# Altium project Nixie-imponator-pcb-boost.PrjPCB
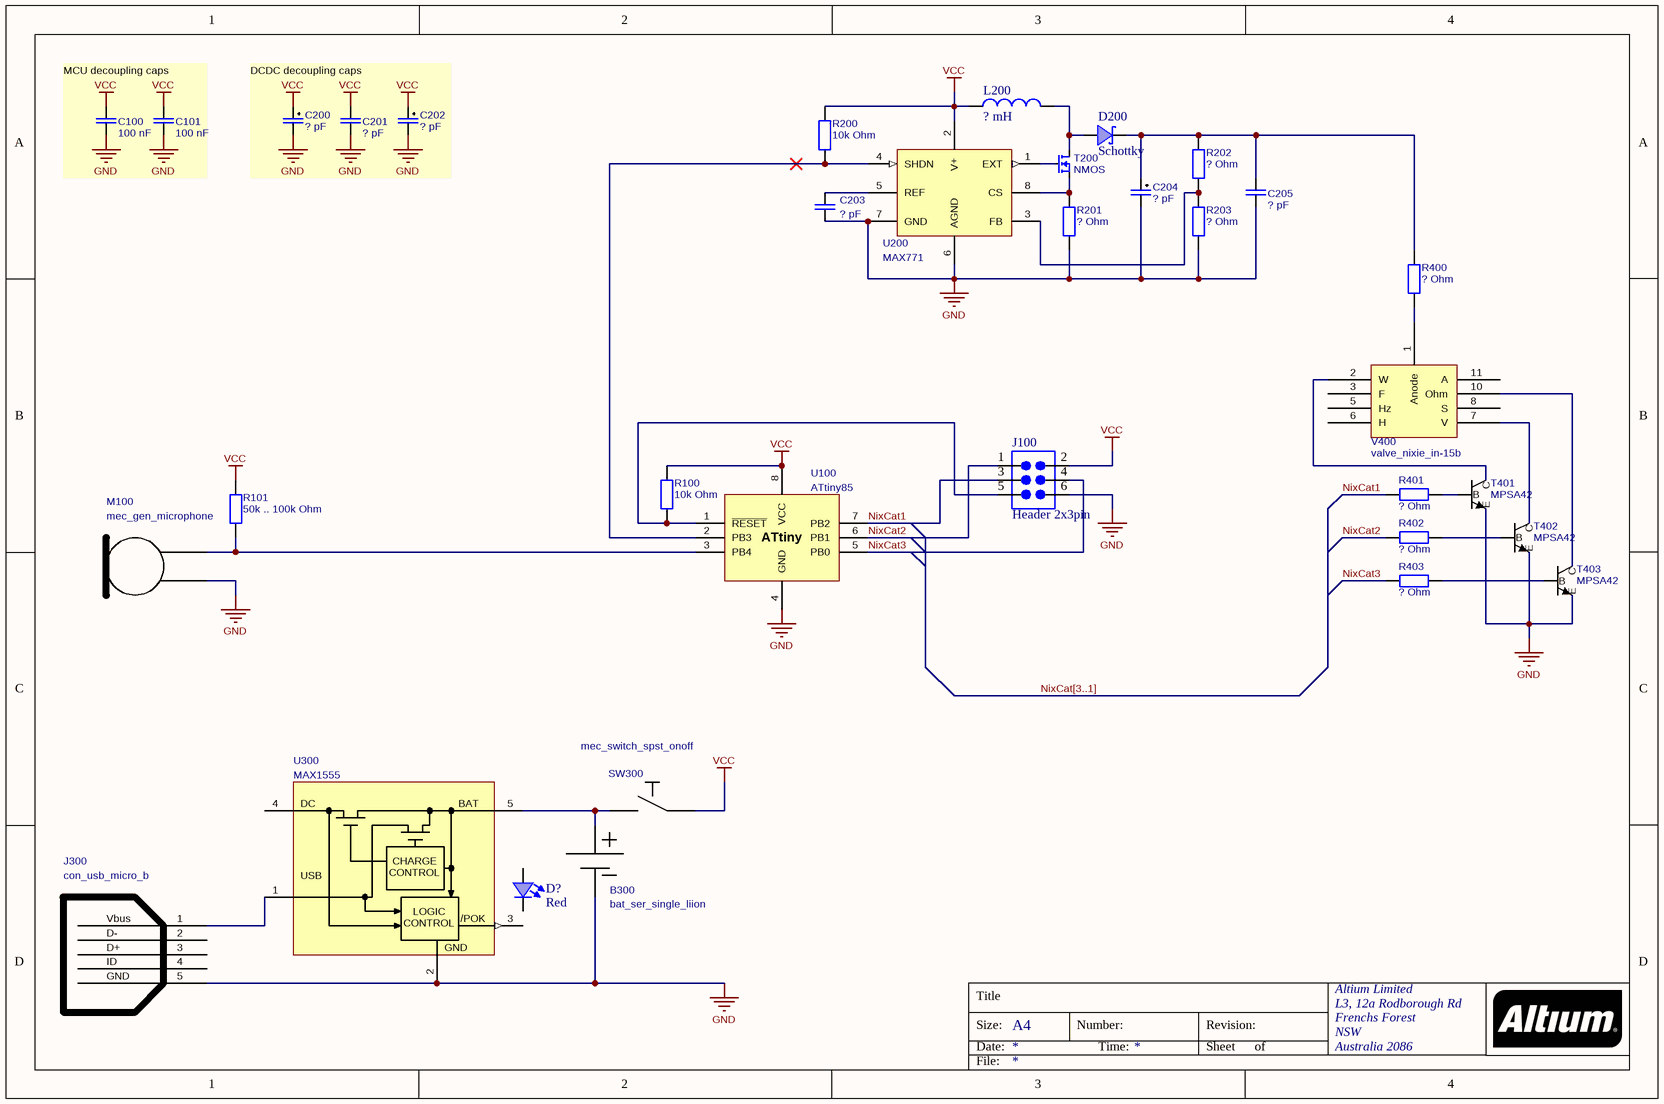
[diagram p0: Nixie-imp-boost-v1.SchDoc]
1 sheet, 34 parts. Net scope: global (net labels, ports and power ports of the same name join across sheets).
Board file: nixie-imp-v1.PcbDoc

## Sheet Nixie-imp-boost-v1.SchDoc
size A4; Organization: Altium Limited; Address1: L3, 12a Rodborough Rd; Address2: Frenchs Forest; Address3: NSW; Address4: Australia 2086

### Parts
B300  bat_ser_single_liion
C100  100 nF
C101  100 nF
C200  ? pF
C201  ? pF
C202  ? pF
C203  ? pF
C204  ? pF
C205  ? pF
D200  Schottky
D?  Red
J100  Header 2x3pin  [header_2x3]
J300  con_usb_micro_b
L200  ? mH  [ELLATV]
M100  mec_gen_microphone
R100  10k Ohm
R101  50k .. 100k Ohm
R200  10k Ohm
R201  ? Ohm
R202  ? Ohm
R203  ? Ohm
R400  ? Ohm
R401  ? Ohm
R402  ? Ohm
R403  ? Ohm
SW300  mec_switch_spst_onoff
T200  NMOS
T401  MPSA42
T402  MPSA42
T403  MPSA42
U100  ATtiny85
U200  MAX771
U300  MAX1555
V400  valve_nixie_in-15b

### Nets
GND: B300.2(-) C100.1 C101.1 C200.1 C201.1 C202.1 C203.1 C204.1 C205.1 J100.6 J300.5(GND) M100.Negative_output R201.2 R203.2 T401.E T402.E T403.E U100.4(GND) U200.6(AGND) U200.7(GND) U300.2(GND)
VCC: C100.2 C101.2 C200.2 C201.2 C202.2 J100.2 L200.1 R100.1 R101.1 R200.1 SW300.2 U100.8(VCC) U200.2(V+)
NixCat1: J100.3 R401.2 U100.7(PB2)
NixCat2: J100.1 R402.2 U100.6(PB1)
NixCat3: J100.4 R403.2 U100.5(PB0)
NetB300_1: B300.1(+) SW300.1 U300.5(BAT)
NetC203_2: C203.2 U200.5(REF)
NetC204_2: C204.2 C205.2 D200.2(C) R202.1 R400.1
NetD200_1: D200.1(A) L200.2 T200.D
NetJ100_5: J100.5 R100.2 U100.1(~{RESET})
NetJ300_1: J300.1(Vbus) U300.1(USB)
NetM100_Positive output: M100.Positive_output R101.2 U100.3(PB4)
NetR200_2: R200.2 U100.2(PB3) U200.4(SHDN)
NetR201_1: R201.1 T200.S U200.8(CS)
NetR202_2: R202.2 R203.1 U200.3(FB)
NetR400_2: R400.2 V400.1(Anode)
NetR401_1: R401.1 T401.B
NetR402_1: R402.1 T402.B
NetR403_1: R403.1 T403.B
NetT200_G: T200.G U200.1(EXT)
NetT401_C: T401.C V400.2(W)
NetT402_C: T402.C V400.7(V)
NetT403_C: T403.C V400.10(Ohm)

Not connected (* = marked no-connect by the designer): D? 1(A) 2(C); J300 2(D-) 3(D+) 4(ID); U300 3(~{PO}K_~{(CH}G)) 4(DC); V400 3(F) 5(Hz) 6(H) 8(S) 11(A)

### Buses and harness runs
bus NixCat[3..1]

### Notes on the sheet
- MCU decoupling caps
- DCDC decoupling caps
- (near R203) Maybe add potmeter to adjust voltage?
- (near R400) This resistor must be sized so to limit the anode current. If not, the anode will burn up!
- Title
- Size:
- Date:
- A4
- Number:
- Time:
- Revision:
- Sheet
- of
- File:
- (in symbol ic_batteryCharger_max1555) CHARGE / CONTROL; /POK; LOGIC / CONTROL
- (in symbol ic_mcu_8bit_atmel_attiny_25_45_85) ATtiny

### Library data of the parts
C100 C101 C201 C203 C205 = cap__genCapUnipol: Generic unipolarised capasitor; Voltage rating: ? V
  C100 C101: Value: 100 nF
  C201 C203 C205: Value: ? pF
C200 C202 C204 = cap__genCapPolar: Generic polarised capasitor; Voltage rating: ? V; Value: ? pF
D200 = dio__genSchottkyDiode: Generic Schottky Diode
D? = dio__genLED: Generic Single-color Light Emitting Diode - LED; Color: Red
J100 = con_head_2x03pin
L200 = ind__genInductorFixedAirCore: Generic inductor with air gap; Value: ? mH
R100 R101 R200-R203 R400-R403 = res__genResistor: Generic resistor; Watt rating: ? mW
  R100 R200: Value: 10k Ohm
  R101: Value: 50k .. 100k Ohm
  R201-R203 R400-R403: Value: ? Ohm
SW300 = mec_switch_spst_onoff: Single pole, single throw, on off switch; Current rating: *; Voltage rating: *; Watt rating: *
T200 = transi__gen_nmos: Generic N-channel Enhancement MOS Transistor; Technology: NMOS
T401-T403 = transi__genNPN: Generic NPN Transistor; Std: IEEE Std 315-1975
U100 = ic_mcu_8bit_atmel_attiny_25_45_85
U200 = ic_vreg_dcdc_max771
U300 = ic_batteryCharger_max1555: MAX1551/1555 Li-Ion battery charger IC
V400 = valve_nixie_in-15b: IN-15b Nixie tube; Working voltage: 180V; Forward current: 3mA; Ignite voltage: *